# Altium schematic sheet LNA_1.7GHz_main_board.SchDoc: {Наименование}
size 420 x 297 mm; ApprovedBy: {Утвердил}; CheckedBy: {Проверил}; DrawnBy: {Разраб.}; DocumentNumber: АБВГ 123456.789 00; SheetNumber: 2; SheetTotal: 3; Scale: {Мш.}; PageSetup: Record=PageOptions|CenterHorizontal=False|CenterVertical=False|PrintScale=0.95|XCorrection=0.00|YCorrection=0.00|PrintKind=1|BorderSize=5000000|LeftOffset=0|BottomOffset=0|Orientation=1|PaperLength=1000|PaperWidth=1000|Scale=100|PaperSource=15|PrintQuality=600|MediaType=1|DitherType=10|PaperKind=A4|PrintScaleMode=1; ProcessInspection: {Т.контр.}; Mass: {М.}; NormInspection: {Н.контр.}; Letter1Column: {}; Letter2Column: {}; Letter3Column: {}; DocumentType: {Документ}; Rule: PcbType=ProtelPcb
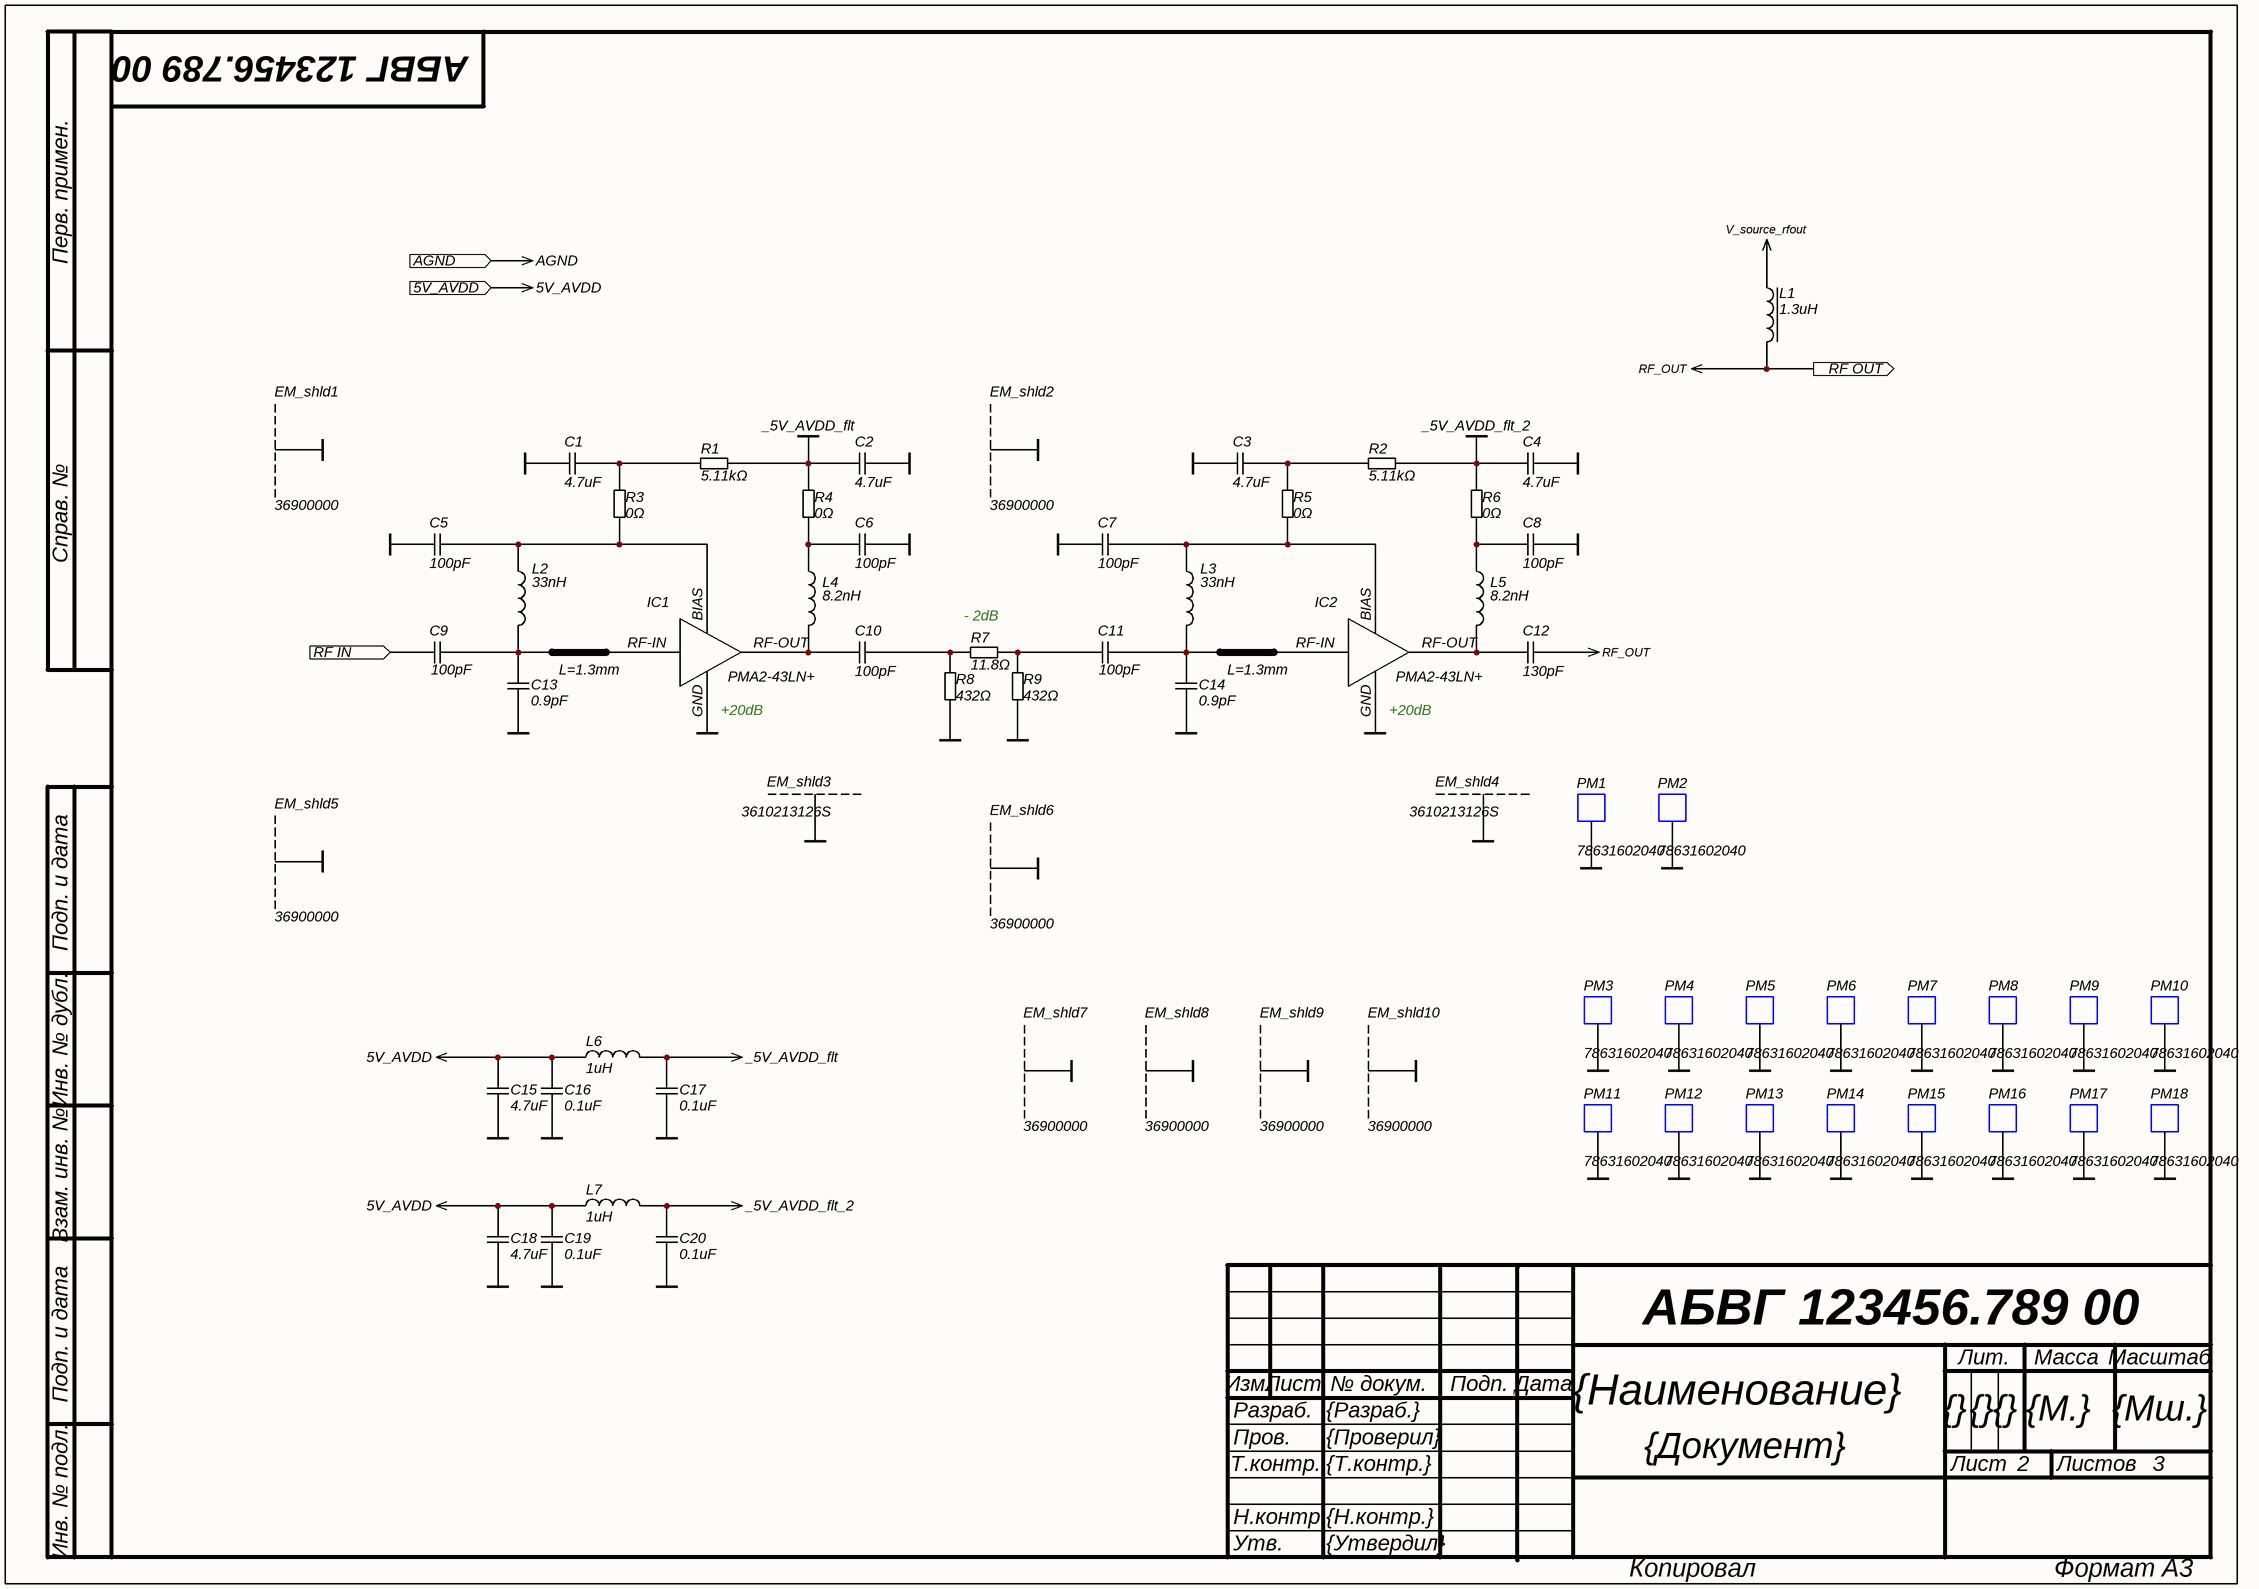
[diagram p0: LNA_1.7GHz_main_board.SchDoc]

## Parts
C1  4.7uF  [C0603]
C2  4.7uF  [C0603]
C3  4.7uF  [C0603]
C4  4.7uF  [C0603]
C5  100pF  [C0603]
C6  100pF  [C0603]
C7  100pF  [C0603]
C8  100pF  [C0603]
C9  100pF  [C0603]
C10  100pF  [C0603]
C11  100pF  [C0603]
C12  130pF  [C0603]
C13  0.9pF  [C0603]
C14  0.9pF  [C0603]
C15  4.7uF  [C0603]
C16  0.1uF  [C0603]
C17  0.1uF  [C0603]
C18  4.7uF  [C0603]
C19  0.1uF  [C0603]
C20  0.1uF  [C0603]
EM_shld1  36900000  [36900000]
EM_shld2  36900000  [36900000]
EM_shld3  3610213126S  [3610213126S]
EM_shld4  3610213126S  [3610213126S]
EM_shld5  36900000  [36900000]
EM_shld6  36900000  [36900000]
EM_shld7  36900000  [36900000]
EM_shld8  36900000  [36900000]
EM_shld9  36900000  [36900000]
EM_shld10  36900000  [36900000]
IC1  PMA2-43LN+  [MC1631-1_MNC-L]
IC2  PMA2-43LN+  [MC1631-1_MNC-L]
L1  1.3uH  [4310LC]
L2  33nH  [L0603_HP]
L3  33nH  [L0603_HP]
L4  8.2nH  [L0603_HP]
L5  8.2nH  [L0603_HP]
L6  1uH  [L1206_Murata]
L7  1uH  [L1206_Murata]
PM1  78631602040  [78631602040]
PM2  78631602040  [78631602040]
PM3  78631602040  [78631602040]
PM4  78631602040  [78631602040]
PM5  78631602040  [78631602040]
PM6  78631602040  [78631602040]
PM7  78631602040  [78631602040]
PM8  78631602040  [78631602040]
PM9  78631602040  [78631602040]
PM10  78631602040  [78631602040]
PM11  78631602040  [78631602040]
PM12  78631602040  [78631602040]
PM13  78631602040  [78631602040]
PM14  78631602040  [78631602040]
PM15  78631602040  [78631602040]
PM16  78631602040  [78631602040]
PM17  78631602040  [78631602040]
PM18  78631602040  [78631602040]
R1  5.11kΩ  [R0603]
R2  5.11kΩ  [R0603]
R3  0Ω  [R0603]
R4  0Ω  [R0603]
R5  0Ω  [R0603]
R6  0Ω  [R0603]
R7  11.8Ω  [R0603]
R8  432Ω  [R0603]
R9  432Ω  [R0603]

## Ports
5V_AVDD (in), AGND (in), RF IN (in), RF OUT (out)

## Nets
5V_AVDD: C15.2 C16.2 C18.2 C19.2 L6.2 L7.2 ; port 5V_AVDD
_5V_AVDD_flt: C2.1 C17.2 L6.1 R1.1 R4.2
_5V_AVDD_flt_2: C4.1 C20.2 L7.1 R2.1 R6.2
AGND: C1.1 C2.2 C3.1 C4.2 C5.1 C6.2 C7.1 C8.2 C13.1 C14.1 C15.1 C16.1 C17.1 C18.1 C19.1 C20.1 EM_shld1.1 EM_shld2.1 EM_shld3.1 EM_shld4.1 EM_shld5.1 EM_shld6.1 EM_shld7.1 EM_shld8.1 EM_shld9.1 EM_shld10.1 IC1.GND IC2.GND PM1.1 PM2.1 PM3.1 PM4.1 PM5.1 PM6.1 PM7.1 PM8.1 PM9.1 PM10.1 PM11.1 PM12.1 PM13.1 PM14.1 PM15.1 PM16.1 PM17.1 PM18.1 R8.2 R9.2 ; port AGND
RF_OUT: C12.1 L1.1 ; port RF OUT
V_source_rfout: L1.2
RF IN: C9.1 ; port RF IN
NetC1_2: C1.2 R1.2 R3.2
NetC3_2: C3.2 R2.2 R5.2
NetC5_2: C5.2 IC1.BIAS L2.1 R3.1
NetC6_1: C6.1 L4.1 R4.1
NetC7_2: C7.2 IC2.BIAS L3.1 R5.1
NetC8_1: C8.1 L5.1 R6.1
NetC9_2: C9.2 C13.2 IC1.RF-IN L2.2
NetC10_1: C10.1 IC1.RF-OUT L4.2
NetC10_2: C10.2 R7.2 R8.1
NetC11_1: C11.1 R7.1 R9.1
NetC11_2: C11.2 C14.2 IC2.RF-IN L3.2
NetC12_2: C12.2 IC2.RF-OUT L5.2

## Notes on the sheet
- (near R7) - 2dB
- L=1.3mm
- (near IC1) +20dB
- (near IC2) +20dB
- Перв. примен.
- Справ. №
- Подп. и дата
- Инв. № дубл.
- Взам. инв. №
- Изм.
- Лист
- № докум.
- Подп.
- Дата
- Лит.
- Масса
- Масштаб
- Т.контр.
- Пров.
- Разраб.
- Листов
- Инв. № подл.
- Н.контр.
- Утв.
- Копировал
- Формат А3

## Library data of the parts
C1-C11 C13-C20 = CAP: Керамический конденсатор; Корпус: 0603 [1608 Метрический]; Диэлектрик: X5R; Напряжение: 16B; Вид монтажа: SMD; Температурный диапазон: -55 ~ 100; Тип элемента: Керамический конденсатор
  C1-C4 C15 C18: Номинал: 4.7uF
  C5-C11: Номинал: 100pF
  C13 C14: Номинал: 0.9pF
  C16 C17 C19 C20: Номинал: 0.1uF
C12 = CAP: Керамический конденсатор; Корпус: 0603 (1608 Metric); Диэлектрик: X7R; Напряжение: 50B; Вид монтажа: SMD; Температурный диапазон: -55 ~ 100; Номинал: 130pF; Тип элемента: Керамический конденсатор
EM_shld1 EM_shld2 EM_shld5-EM_shld10 = RF Shield: RF Shield Frame X 0.522" (13.26mm) Surface Mount; Производитель: Wurth Elektronik; Вид монтажа: SMD/SMT; Тип элемента: EMI/RFI Shield, One-Piece; Название: 36900000; Артикул: 36900000
EM_shld3 EM_shld4 = RF Shield: RF Shield Frame X 0.522" (13.26mm) Surface Mount; Производитель: Wurth Elektronik; Вид монтажа: SMD/SMT; Тип элемента: EMI/RFI Shield, One-Piece; Примечание: Mate with 3600213120S (Two pieces shield); Артикул: 3610213126S; Корпус: 0.522" (13.26mm)
IC1 IC2 = PMA2-43LN+: Малошумяший усилитель; Производитель: Mini-Circuits; Вид монтажа: SMD; Тип элемента: Микросхема; Температурный диапазон: -40 ~ 100; Название: PMA2-43LN+; Артикул: PMA2-43LN+
L1 = 4310LC: Индуктивность; Производитель: Coilcraft; Вид монтажа: SMD; Тип элемента: Катушка индуктивности; Температурный диапазон: -40ºC to 125ºC; Примечание: 3A; Название: 4310lc; Артикул: 4310lc; Номинал: 1.3uH
L2-L5 = Inducror RF: Индуктивность; Производитель: Coilcraft; Корпус: 0603 [1608 Метрический]; Вид монтажа: SMD; Тип элемента: Катушка индуктивности; Температурный диапазон: -40ºC to 125ºC
  L2 L3: Номинал: 33nH
  L4 L5: Номинал: 8.2nH
L6 L7 = Inducror LF: Индуктивность; Производитель: Murata; Корпус: 1206 [3216 Metric]; Вид монтажа: SMD; Тип элемента: Катушка индуктивности; Температурный диапазон: -40ºC to 125ºC; Номинал: 1uH
PM1-PM18 = 78631602040: WE-SCFA Soldered Contact Finger Automotive, L6W2H4mm, Working Height 5~5.7mm; Производитель: Wurth Elektronik; Вид монтажа: SMD/SMT; Артикул: 78631602040
R1-R9 = RES: SMD резистор; Производитель: 1%; Корпус: 0603 [1608 Метрический]; Точность: 1%; Название: Резистор; Вид монтажа: SMD; Тип элемента: Резистор
  R1 R2: Номинал: 5.11kΩ
  R3-R6: Номинал: 0Ω
  R7: Номинал: 11.8Ω
  R8 R9: Номинал: 432Ω